# Altium schematic sheet PCB_SBW_Assist.SchDoc
size A2
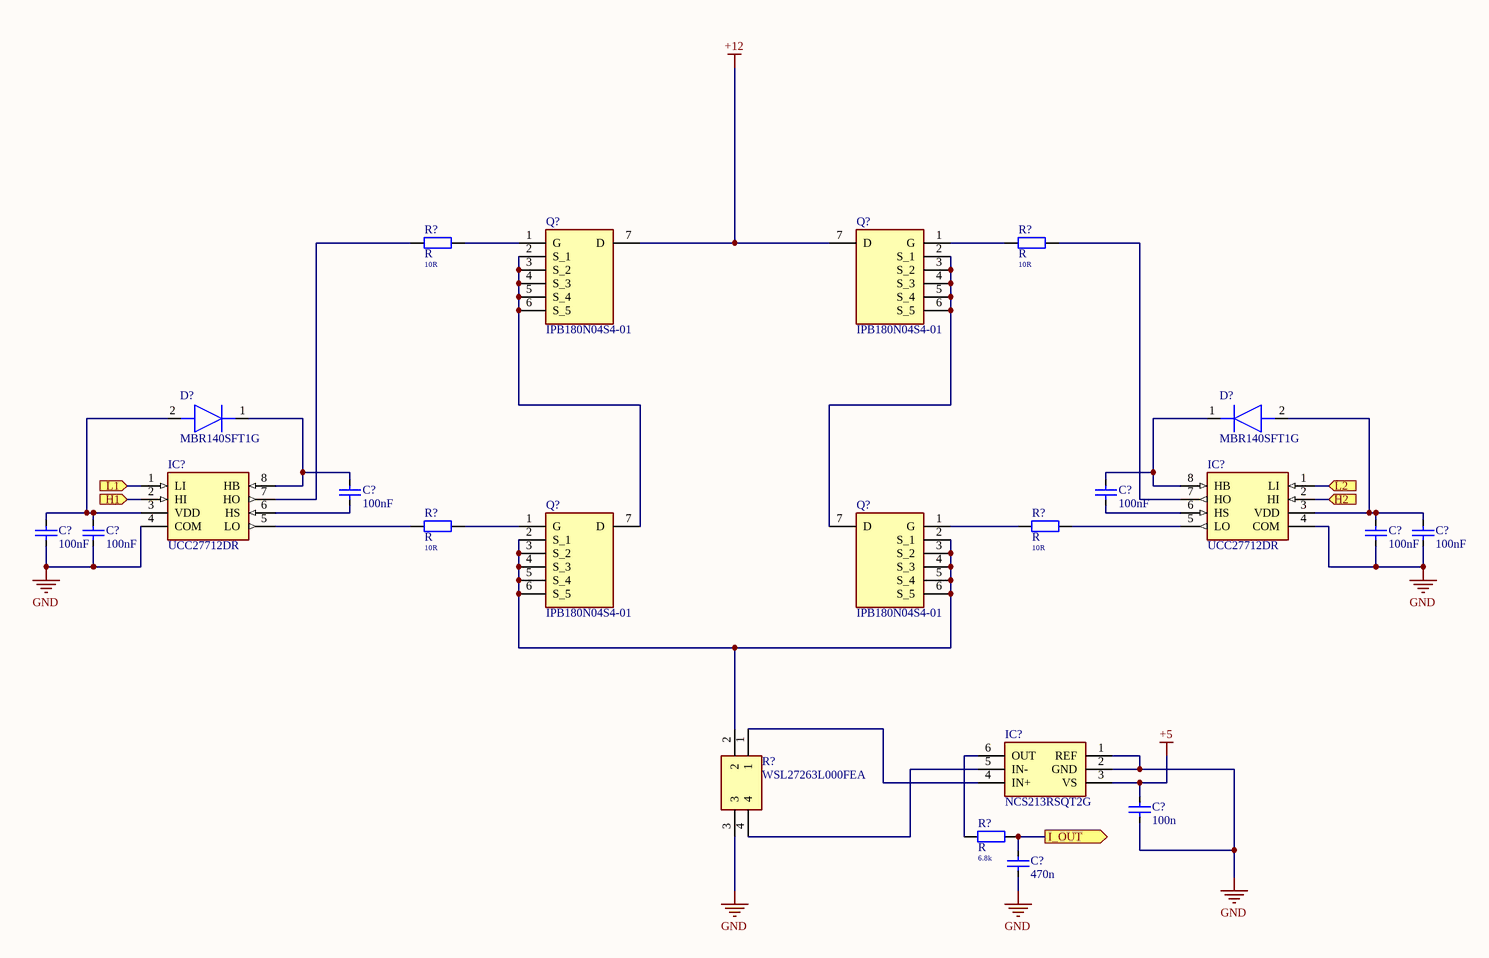
[diagram p0: PCB_SBW_Assist.SchDoc]

## Parts
(Parts that share a designator on the sheet are numbered #1, #2 ... from top to bottom, then left to right.)
C?#1  value 100nF  [CAPC3216X18N]  (hidden comment: C)
C?#2  value 100nF  [CAPC3216X18N]  (hidden comment: C)
C?#3  value 100nF  [CAPC3216X18N]  (hidden comment: C)
C?#4  value 100nF  [CAPC3216X18N]  (hidden comment: C)
C?#5  value 100nF  [CAPC3216X18N]  (hidden comment: C)
C?#6  value 100nF  [CAPC3216X18N]  (hidden comment: C)
C?#7  value 100n  [CAPC3216X18N]  (hidden comment: C)
C?#8  value 470n  [CAPC3216X18N]  (hidden comment: C)
D?#1  MBR140SFT1G  [SODFL3616X98N]
D?#2  MBR140SFT1G  [SODFL3616X98N]
IC?#1  UCC27712DR  [SOIC127P600X175-8N]
IC?#2  UCC27712DR  [SOIC127P600X175-8N]
IC?#3  NCS213RSQT2G  [SOT65P210X110-6N]
Q?#1  IPB180N04S4-01  [IPB240N04S4R9ATMA1]
Q?#2  IPB180N04S4-01  [IPB240N04S4R9ATMA1]
Q?#3  IPB180N04S4-01  [IPB240N04S4R9ATMA1]
Q?#4  IPB180N04S4-01  [IPB240N04S4R9ATMA1]
R?#1  R  value 10R  [RESC3216X07N]
R?#2  R  value 10R  [RESC3216X07N]
R?#3  R  value 10R  [RESC3216X07N]
R?#4  R  value 10R  [RESC3216X07N]
R?#5  WSL27263L000FEA  [WSL27263L000FEA]
R?#6  R  value 6.8k  [RESC1608X06N]

## Ports
H1 (in), H2 (in), I_OUT (out), L1 (in), L2 (in)

## Nets
+5: C?#7.2 IC?#3.3(VS)
+12: Q?#1.7(D) Q?#2.7(D)
GND: C?#3.1 C?#4.1 C?#5.1 C?#6.1 C?#7.1 C?#8.1 IC?#1.4(COM) IC?#2.4(COM) IC?#3.1(REF) IC?#3.2(GND) R?#5.3
H1: IC?#1.2(HI) ; port H1
H2: IC?#2.2(HI) ; port H2
I_OUT: C?#8.2 R?#6.2 ; port I_OUT
L1: IC?#1.1(LI) ; port L1
L2: IC?#2.1(LI) ; port L2
NetC?#1_1: C?#1.1 IC?#1.6(HS)
NetC?#1_2: C?#1.2 D?#1.1(K) IC?#1.8(HB)
NetC?#2_1: C?#2.1 IC?#2.6(HS)
NetC?#2_2: C?#2.2 D?#2.1(K) IC?#2.8(HB)
NetC?#3_2: C?#3.2 C?#4.2 D?#1.2(A) IC?#1.3(VDD)
NetC?#5_2: C?#5.2 C?#6.2 D?#2.2(A) IC?#2.3(VDD)
NetIC?#1_5: IC?#1.5(LO) R?#3.1
NetIC?#1_7: IC?#1.7(HO) R?#1.1
NetIC?#2_5: IC?#2.5(LO) R?#4.2
NetIC?#2_7: IC?#2.7(HO) R?#2.2
NetIC?#3_4: IC?#3.4(IN+) R?#5.1
NetIC?#3_5: IC?#3.5(IN-) R?#5.4
NetIC?#3_6: IC?#3.6(OUT) R?#6.1
NetQ?#1_1: Q?#1.1(G) R?#1.2
NetQ?#1_2: Q?#1.2(S_1) Q?#1.3(S_2) Q?#1.4(S_3) Q?#1.5(S_4) Q?#1.6(S_5) Q?#3.7(D)
NetQ?#2_1: Q?#2.1(G) R?#2.1
NetQ?#2_2: Q?#2.2(S_1) Q?#2.3(S_2) Q?#2.4(S_3) Q?#2.5(S_4) Q?#2.6(S_5) Q?#4.7(D)
NetQ?#3_1: Q?#3.1(G) R?#3.2
NetQ?#3_2: Q?#3.2(S_1) Q?#3.3(S_2) Q?#3.4(S_3) Q?#3.5(S_4) Q?#3.6(S_5) Q?#4.2(S_1) Q?#4.3(S_2) Q?#4.4(S_3) Q?#4.5(S_4) Q?#4.6(S_5) R?#5.2
NetQ?#4_1: Q?#4.1(G) R?#4.1

## Notes on the sheet
- Title
- Size:
- Date:
- File:
- A2
- Number:
- Time:
- Revision:
- Sheet
- of

## Library data of the parts
C?#1-C?#6 = C: Parameter 2: 06033C104KAT4A; Link: https://www.lcsc.com/product-detail/Multilayer-Ceramic-Capacitors-MLCC-SMD-SMT_Kyocera-AVX-06033C104KAT4A_C2167104.html
C?#7 = C: MPN: 06033C104KAT4A; Link: https://www.lcsc.com/product-detail/Multilayer-Ceramic-Capacitors-MLCC-SMD-SMT_Kyocera-AVX-06033C104KAT4A_C2167104.html
C?#8 = C: MPN: Samwha Capacitor CS1608X7R474K250NRB; Link: https://www.lcsc.com/product-detail/Multilayer-Ceramic-Capacitors-MLCC-SMD-SMT_Samwha-Capacitor-CS1608X7R474K250NRB_C2909628.html
D?#1 D?#2 = MBR140SFT1G: Diode; Manufacturer_Name: onsemi; Datasheet Link: http://www.onsemi.com/pub/Collateral/MBR140SFT1-D.PDF; Height: 0.98mm; Manufacturer_Part_Number: MBR140SFT1G; Mouser Part Number: 863-MBR140SFT1G; Mouser Price/Stock: https://www.mouser.co.uk/ProductDetail/onsemi/MBR140SFT1G?qs=3JMERSakebrc0eIUjXPasA%3D%3D; Arrow Part Number: MBR140SFT1G; Arrow Price/Stock: https://www.arrow.com/en/products/mbr140sft1g/on-semiconductor?region=nac
IC?#1 IC?#2 = UCC27712DR: Integrated Circuit; Manufacturer_Name: Texas Instruments; Datasheet Link: http://www.ti.com/lit/gpn/ucc27712; Height: 1.75mm; Manufacturer_Part_Number: UCC27712DR; Mouser Part Number: 595-UCC27712DR; Mouser Price/Stock: https://www.mouser.co.uk/ProductDetail/Texas-Instruments/UCC27712DR?qs=HXFqYaX1Q2zHY4iSzkrxAA%3D%3D; Arrow Part Number: UCC27712DR; Arrow Price/Stock: https://www.arrow.com/en/products/ucc27712dr/texas-instruments?region=nac
IC?#3 = NCS213RSQT2G: Integrated Circuit; Manufacturer_Name: onsemi; Datasheet Link: http://www.onsemi.com/pub/Collateral/NCS210R-D.PDF; Height: 1.1mm; Manufacturer_Part_Number: NCS213RSQT2G; Mouser Part Number: 863-NCS213RSQT2G; Mouser Price/Stock: https://www.mouser.co.uk/ProductDetail/onsemi/NCS213RSQT2G?qs=y6ZabgHbY%252ByBI46PuwlxCQ%3D%3D; Arrow Part Number: NCS213RSQT2G; Arrow Price/Stock: https://www.arrow.com/en/products/ncs213rsqt2g/on-semiconductor?region=nac
Q?#1-Q?#4 = IRFS3107-7PPBF: MOSFET (N-Channel); Manufacturer_Name: Infineon; Datasheet Link: https://www.lcsc.com/datasheet/lcsc_datasheet_2409301305_Infineon-Technologies-IPB180N04S4-01_C536569.pdf; Height: 4mm; Manufacturer_Part_Number: IPB180N04S4-01; Mouser Part Number: 942-IRFS3107-7PPBF; Mouser Price/Stock: https://www.lcsc.com/product-detail/MOSFETs_Infineon-Technologies-IPB180N04S4-01_C536569.html; Arrow Part Number: IPB180N04S4-01; Arrow Price/Stock: https://www.arrow.com/en/products/irfs3107-7ppbf/infineon-technologies-ag
R?#1-R?#4 = R: MPN: 1206W4F100JT5E; Link: https://www.lcsc.com/product-detail/Chip-Resistor-Surface-Mount_UNI-ROYAL-Uniroyal-Elec-1206W4F100JT5E_C17903.html
R?#5 = WSL27263L000FEA: Resistor; Manufacturer_Name: Vishay; Datasheet Link: https://www.vishay.com/docs/30131/wsl2726.pdf; Height: 2.99mm; Manufacturer_Part_Number: WSL27263L000FEA; Mouser Part Number: 71-WSL27263L000FEA; Mouser Price/Stock: https://www.mouser.co.uk/ProductDetail/Vishay-Dale/WSL27263L000FEA?qs=eFWhpKjIuGhZ1Mn4MB4N%252Bg%3D%3D; Arrow Part Number: WSL27263L000FEA; Arrow Price/Stock: https://www.arrow.com/en/products/wsl27263l000fea/vishay
R?#6 = R: MPN: YAGEO RC0603FR-076K8L; Link: https://www.lcsc.com/product-detail/Chip-Resistor-Surface-Mount_YAGEO-RC0603FR-076K8L_C114632.html